# EAGLE schematic csa_vdc_v1.4b (EAGLE 4.15)
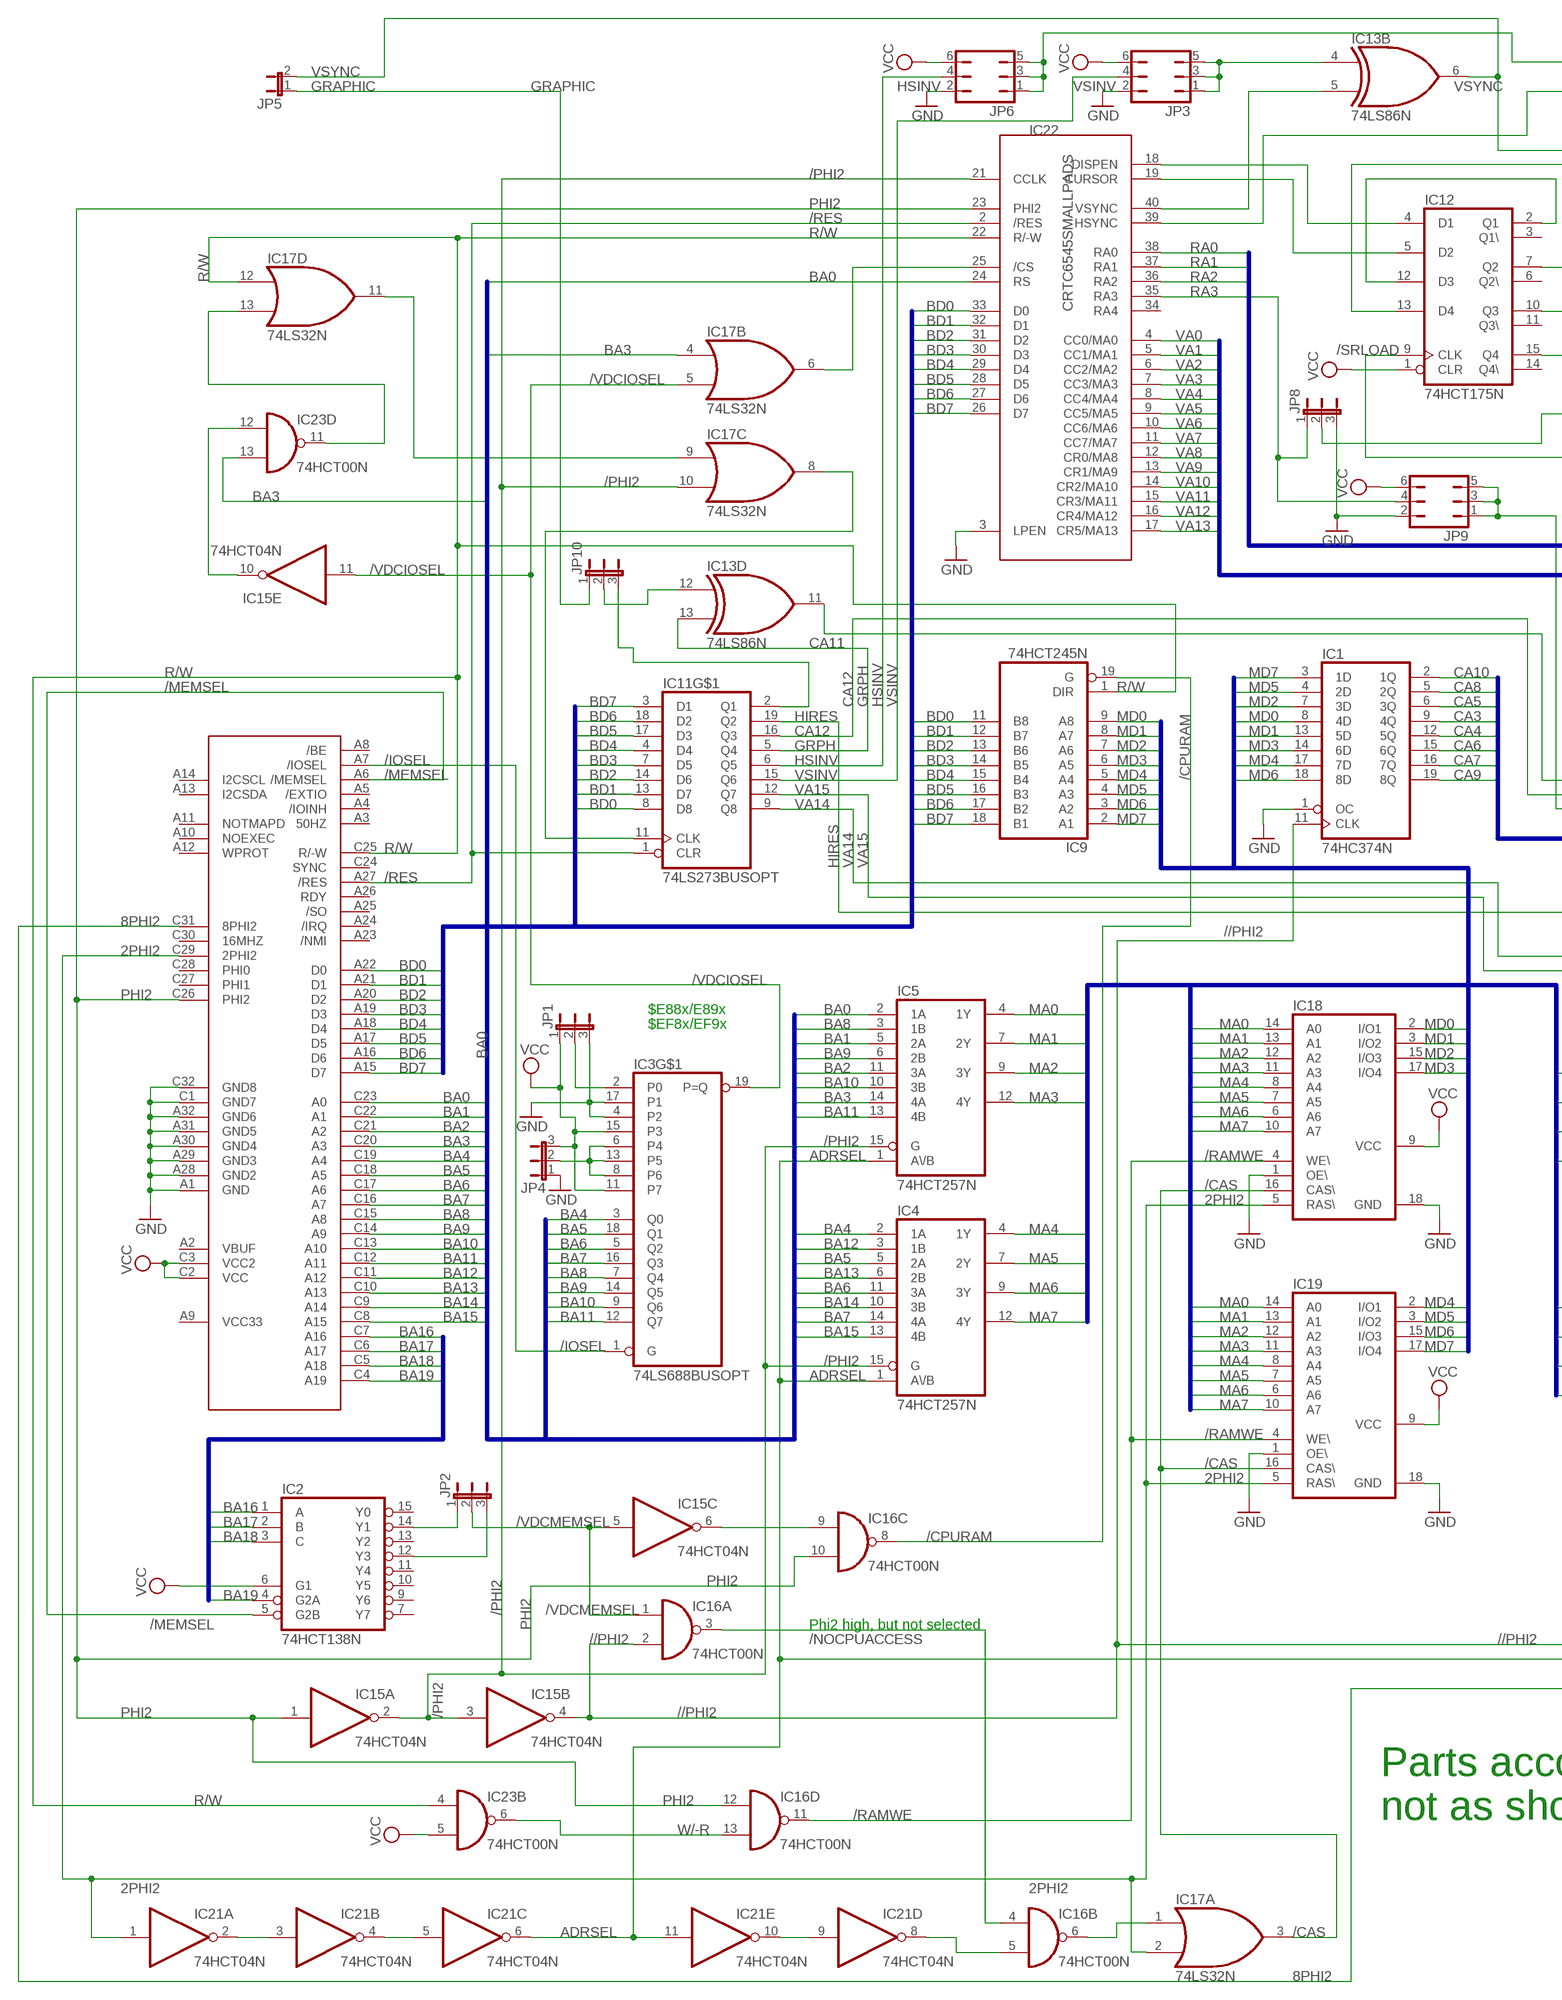
[diagram p0: schematic, sheet 1, part 1 of 2]
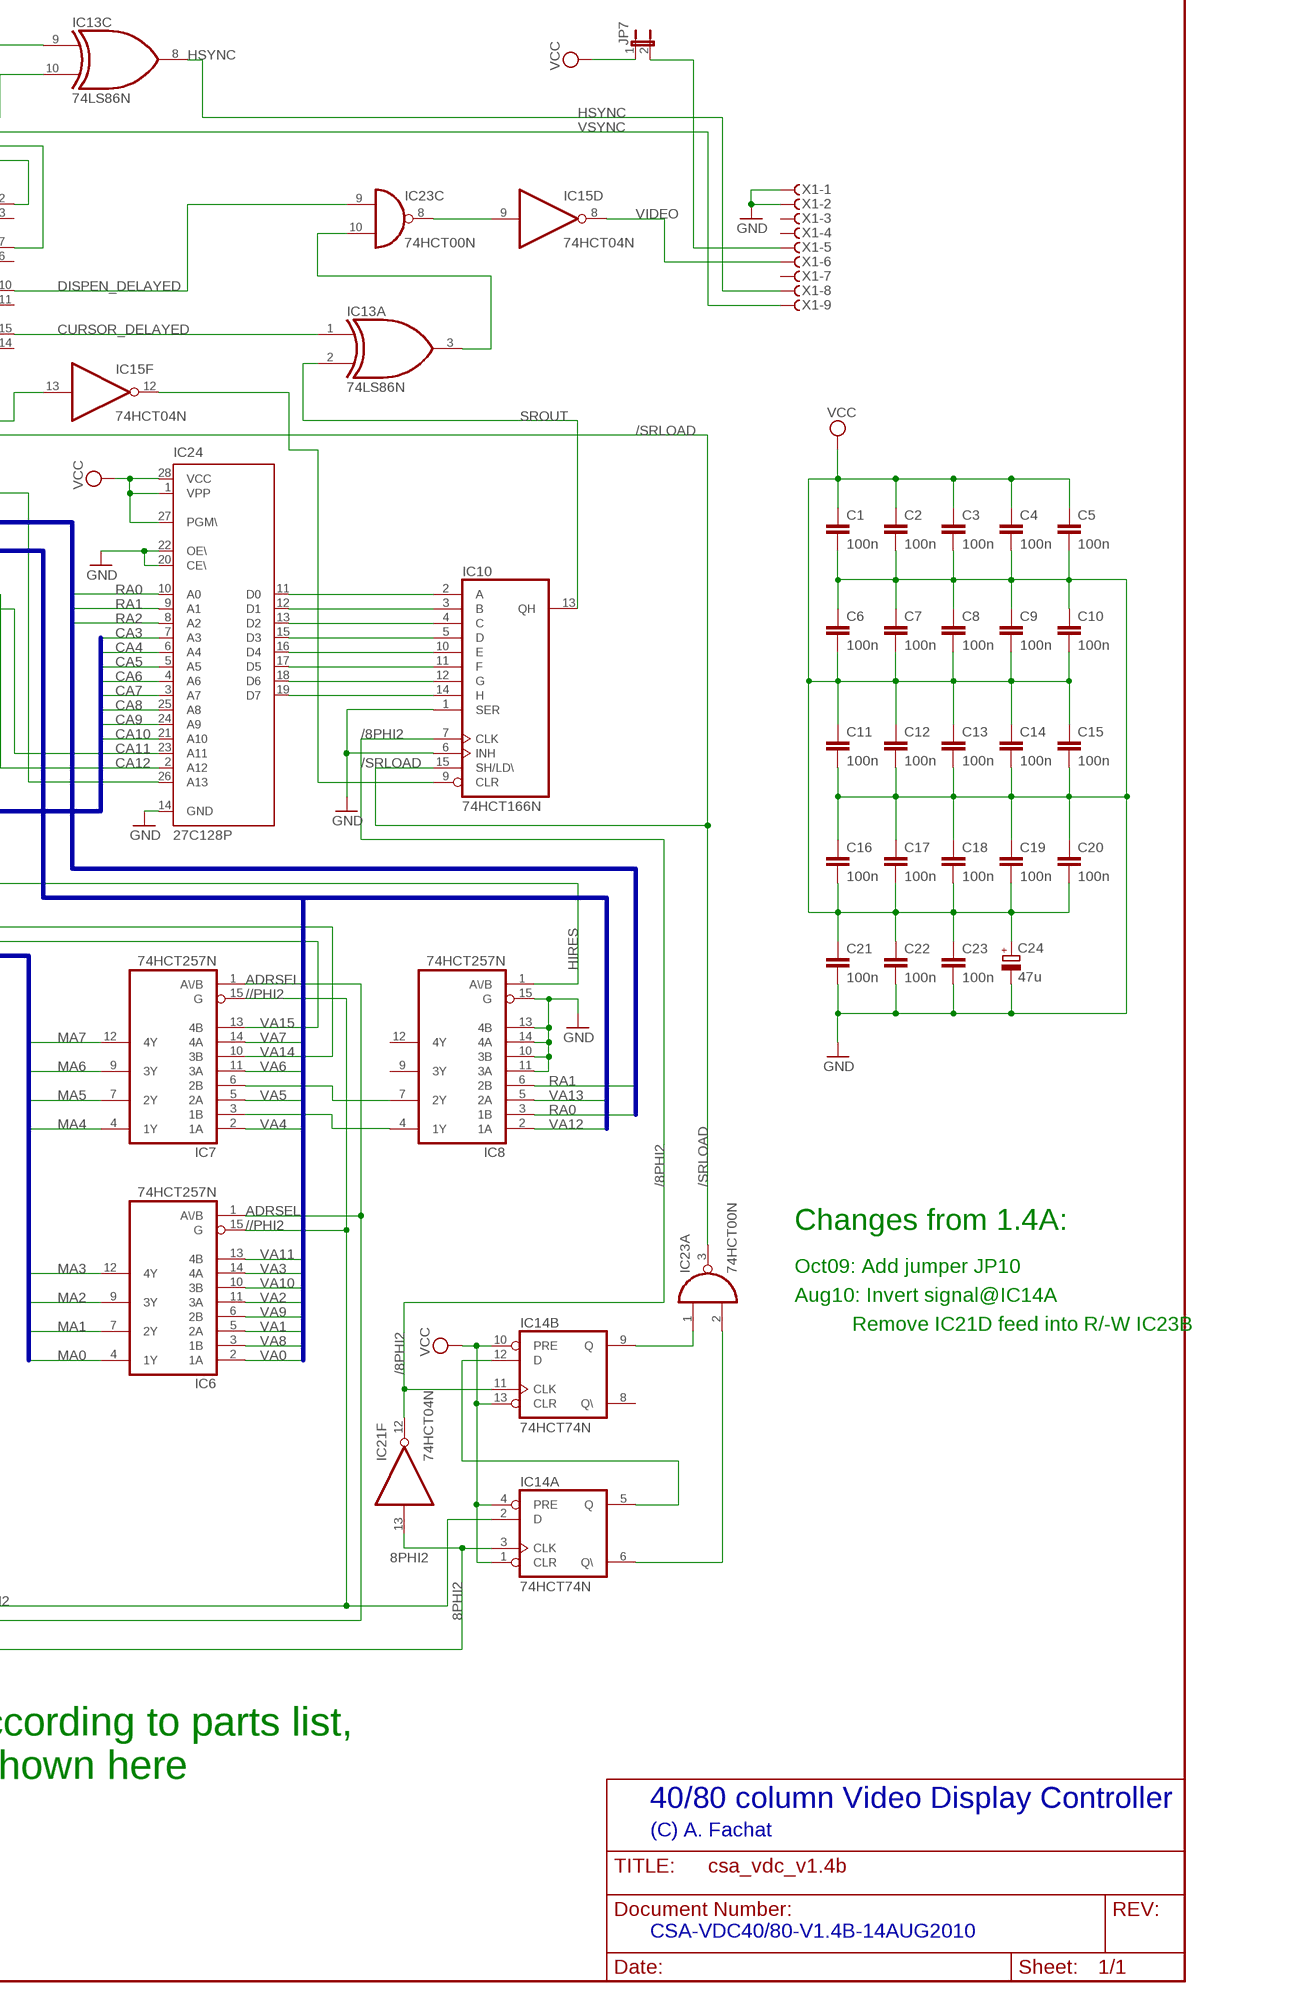
[diagram p1: schematic, sheet 1, part 2 of 2]

## Parts
C1  100n  C-EU025-025X050  [C025-025X050]
C2  100n  C-EU025-025X050  [C025-025X050]
C3  100n  C-EU025-025X050  [C025-025X050]
C4  100n  C-EU025-025X050  [C025-025X050]
C5  100n  C-EU025-025X050  [C025-025X050]
C6  100n  C-EU025-025X050  [C025-025X050]
C7  100n  C-EU025-025X050  [C025-025X050]
C8  100n  C-EU025-025X050  [C025-025X050]
C9  100n  C-EU025-025X050  [C025-025X050]
C10  100n  C-EU025-025X050  [C025-025X050]
C11  100n  C-EU025-025X050  [C025-025X050]
C12  100n  C-EU025-025X050  [C025-025X050]
C13  100n  C-EU025-025X050  [C025-025X050]
C14  100n  C-EU025-025X050  [C025-025X050]
C15  100n  C-EU025-025X050  [C025-025X050]
C16  100n  C-EU025-025X050  [C025-025X050]
C17  100n  C-EU025-025X050  [C025-025X050]
C18  100n  C-EU025-025X050  [C025-025X050]
C19  100n  C-EU025-025X050  [C025-025X050]
C20  100n  C-EU025-025X050  [C025-025X050]
C21  100n  C-EU025-025X050  [C025-025X050]
C22  100n  C-EU025-025X050  [C025-025X050]
C23  100n  C-EU025-025X050  [C025-025X050]
C24  47u  CPOL-EUE2.5-5  [E2,5-5]
IC1  74HC374N  [DIL20]
IC2  74HCT138N  [DIL16]
IC3  74LS688BUSOPT  [DIL20]
IC4  74HCT257N  [DIL16]
IC5  74HCT257N  [DIL16]
IC6  74HCT257N  [DIL16]
IC7  74HCT257N  [DIL16]
IC8  74HCT257N  [DIL16]
IC9  74HCT245N  [DIL20]
IC10  74HCT166N  [DIL16]
IC11  74LS273BUSOPT  [DIL20]
IC12  74HCT175N  [DIL16]
IC13  74LS86N  [DIL14]
IC14  74HCT74N  [DIL14]
IC15  74HCT04N  [DIL14]
IC16  74HCT00N  [DIL14]
IC17  74LS32N  [DIL14]
IC18  41464C  [DIL18]
IC19  41464C  [DIL18]
IC21  74HCT04N  [DIL14]
IC22  CRTC6545SMALLPADS  [DIP40]
IC23  74HCT00N  [DIL14]
IC24  27C128P  [DIL28-6]
JP1  JP2E  [JP2]
JP2  JP2E  [JP2]
JP3  JP3Q  [JP3Q]
JP4  JP2E  [JP2]
JP5  JP1E  [JP1]
JP6  JP3Q  [JP3Q]
JP7  JP1E  [JP1]
JP8  JP2E  [JP2]
JP9  JP3Q  [JP3Q]
JP10  JP2E  [JP2]
U$1  CSABUS  [CSABUS]
X1  F09HPS  [F09HP]

## Nets
2PHI2: IC17.2(A:I1) IC18.5(RAS\) IC19.5(RAS\) IC21.1(A:I) U$1.C29(2PHI2)
8PHI2: IC14.3(A:CLK) IC21.13(F:I) U$1.C31(8PHI2)
/8PHI2: IC10.7(CLK) IC14.11(B:CLK) IC21.12(F:O)
//PHI2: IC1.11(CLK) IC6.15(G) IC7.15(G) IC14.2(A:D) IC15.4(B:O) IC16.2(A:I1)
/CAS: IC17.3(A:O) IC18.16(CAS\) IC19.16(CAS\)
/CPURAM: IC9.19(G) IC16.8(C:O)
/IOSEL: IC3.1(G) U$1.A7(/IOSEL)
/MEMSEL: IC2.5(G2B) U$1.A6(/MEMSEL)
/NOCPUACCESS: IC16.3(A:O) IC16.4(B:I0)
/PHI2: IC4.15(G) IC5.15(G) IC15.2(A:O) IC15.3(B:I) IC17.10(C:I1) IC22.21(CCLK)
/RAMWE: IC16.11(D:O) IC18.4(WE\) IC19.4(WE\)
/RES: IC11.1(CLR) IC22.2(/RES) U$1.A27(/RES)
/SRLOAD: IC10.15(SH/LD\) IC12.9(CLK) IC23.3(A:O)
/VDCIOSEL: IC3.19(P=Q) IC15.11(E:I) IC17.5(B:I1)
/VDCMEMSEL: IC15.5(C:I) IC16.1(A:I0) JP2.2
ADRSEL: IC4.1(A\/B) IC5.1(A\/B) IC6.1(A\/B) IC7.1(A\/B) IC21.6(C:O) IC21.11(E:I)
BA0: IC5.2(1A) IC22.24(RS) U$1.C23(A0)
BA1: IC5.5(2A) U$1.C22(A1)
BA2: IC5.11(3A) U$1.C21(A2)
BA3: IC5.14(4A) IC17.4(B:I0) IC23.13(D:I1) U$1.C20(A3)
BA4: IC3.3(Q0) IC4.2(1A) U$1.C19(A4)
BA5: IC3.18(Q1) IC4.5(2A) U$1.C18(A5)
BA6: IC3.5(Q2) IC4.11(3A) U$1.C17(A6)
BA7: IC3.16(Q3) IC4.14(4A) U$1.C16(A7)
BA8: IC3.7(Q4) IC5.3(1B) U$1.C15(A8)
BA9: IC3.14(Q5) IC5.6(2B) U$1.C14(A9)
BA10: IC3.9(Q6) IC5.10(3B) U$1.C13(A10)
BA11: IC3.12(Q7) IC5.13(4B) U$1.C12(A11)
BA12: IC4.3(1B) U$1.C11(A12)
BA13: IC4.6(2B) U$1.C10(A13)
BA14: IC4.10(3B) U$1.C9(A14)
BA15: IC4.13(4B) U$1.C8(A15)
BA16: IC2.1(A) U$1.C7(A16)
BA17: IC2.2(B) U$1.C6(A17)
BA18: IC2.3(C) U$1.C5(A18)
BA19: IC2.4(G2A) U$1.C4(A19)
BD0: IC9.11(B8) IC11.8(D8) IC22.33(D0) U$1.A22(D0)
BD1: IC9.12(B7) IC11.13(D7) IC22.32(D1) U$1.A21(D1)
BD2: IC9.13(B6) IC11.14(D6) IC22.31(D2) U$1.A20(D2)
BD3: IC9.14(B5) IC11.7(D5) IC22.30(D3) U$1.A19(D3)
BD4: IC9.15(B4) IC11.4(D4) IC22.29(D4) U$1.A18(D4)
BD5: IC9.16(B3) IC11.17(D3) IC22.28(D5) U$1.A17(D5)
BD6: IC9.17(B2) IC11.18(D2) IC22.27(D6) U$1.A16(D6)
BD7: IC9.18(B1) IC11.3(D1) IC22.26(D7) U$1.A15(D7)
CA3: IC1.9(4Q) IC24.7(A3)
CA4: IC1.12(5Q) IC24.6(A4)
CA5: IC1.6(3Q) IC24.5(A5)
CA6: IC1.15(6Q) IC24.4(A6)
CA7: IC1.16(7Q) IC24.3(A7)
CA8: IC1.5(2Q) IC24.25(A8)
CA9: IC1.19(8Q) IC24.24(A9)
CA10: IC1.2(1Q) IC24.21(A10)
CA11: IC13.11(D:O) IC24.23(A11)
CA12: IC11.16(Q3) IC24.2(A12)
CURSOR_DELAYED: IC12.15(Q4) IC13.1(A:I0)
DISPEN_DELAYED: IC12.10(Q3) IC23.9(C:I0)
GND: C1.2 C2.2 C3.2 C4.2 C5.2 C6.1 C7.1 C8.1 C9.1 C10.1 C11.2 C12.2 C13.2 C14.2 C15.2 C16.1 C17.1 C18.1 C19.1 C20.1 C21.2 C22.2 C23.2 C24.- IC1.1(OC) IC3.4(P2) IC3.17(P1) IC8.10(3B) IC8.11(3A) IC8.13(4B) IC8.14(4A) IC8.15(G) IC10.1(SER) IC10.6(INH) IC18.1(OE\) IC18.18(GND) IC19.1(OE\) IC19.18(GND) IC22.3(LPEN) IC24.14(GND) IC24.20(CE\) IC24.22(OE\) JP1.3 JP3.2 JP4.1 JP6.2 JP8.3 JP9.2 U$1.A1(GND) U$1.A28(GND2) U$1.A29(GND3) U$1.A30(GND4) U$1.A31(GND5) U$1.A32(GND6) U$1.C1(GND7) U$1.C32(GND8) X1.1 X1.2
GRAPHIC: JP5.1 JP10.1
GRPH: IC11.5(Q4) IC13.13(D:I1)
HIRES: IC8.1(A\/B) IC11.19(Q2)
HSINV: IC11.6(Q5) JP6.4
HSYNC: IC13.8(C:O) X1.8
MA0: IC5.4(1Y) IC6.4(1Y) IC18.14(A0) IC19.14(A0)
MA1: IC5.7(2Y) IC6.7(2Y) IC18.13(A1) IC19.13(A1)
MA2: IC5.9(3Y) IC6.9(3Y) IC18.12(A2) IC19.12(A2)
MA3: IC5.12(4Y) IC6.12(4Y) IC18.11(A3) IC19.11(A3)
MA4: IC4.4(1Y) IC7.4(1Y) IC18.8(A4) IC19.8(A4)
MA5: IC4.7(2Y) IC7.7(2Y) IC18.7(A5) IC19.7(A5)
MA6: IC4.9(3Y) IC7.9(3Y) IC18.6(A6) IC19.6(A6)
MA7: IC4.12(4Y) IC7.12(4Y) IC18.10(A7) IC19.10(A7)
MD0: IC1.8(4D) IC9.9(A8) IC18.2(I/O1)
MD1: IC1.13(5D) IC9.8(A7) IC18.3(I/O2)
MD2: IC1.7(3D) IC9.7(A6) IC18.15(I/O3)
MD3: IC1.14(6D) IC9.6(A5) IC18.17(I/O4)
MD4: IC1.17(7D) IC9.5(A4) IC19.2(I/O1)
MD5: IC1.4(2D) IC9.4(A3) IC19.3(I/O2)
MD6: IC1.18(8D) IC9.3(A2) IC19.15(I/O3)
MD7: IC1.3(1D) IC9.2(A1) IC19.17(I/O4)
N$9: IC7.3(1B) IC8.4(1Y)
N$10: IC3.2(P0) JP1.2
N$11: IC7.6(2B) IC8.7(2Y)
N$12: IC10.2(A) IC24.11(D0)
N$13: IC10.3(B) IC24.12(D1)
N$14: IC10.4(C) IC24.13(D2)
N$15: IC10.5(D) IC24.15(D3)
N$16: IC10.10(E) IC24.16(D4)
N$17: IC10.11(F) IC24.17(D5)
N$18: IC10.12(G) IC24.18(D6)
N$19: IC10.14(H) IC24.19(D7)
N$20: IC2.14(Y1) JP2.1
N$21: IC2.12(Y3) JP2.3
N$22: IC14.6(A:Q\) IC23.2(A:I1)
N$23: IC14.9(B:Q) IC23.1(A:I0)
N$24: IC11.11(CLK) IC17.8(C:O)
N$25: IC12.4(D1) IC22.18(DISPEN)
N$26: IC3.6(P4) IC3.8(P6) IC3.13(P5) JP4.2
N$27: IC21.2(A:O) IC21.3(B:I)
N$28: IC21.4(B:O) IC21.5(C:I)
N$29: IC12.5(D2) IC22.19(CURSOR)
N$30: IC21.9(D:I) IC21.10(E:O)
N$31: IC13.9(C:I0) JP6.1 JP6.3 JP6.5
N$32: IC16.5(B:I1) IC21.8(D:O)
N$33: IC16.6(B:O) IC17.1(A:I0)
N$34: IC17.13(D:I1) IC23.11(D:O)
N$35: IC15.6(C:O) IC16.9(C:I0)
N$36: IC12.2(Q1) IC12.12(D3)
N$37: IC12.7(Q2) IC12.13(D4)
N$38: IC13.4(B:I0) JP3.1 JP3.3 JP3.5
N$39: IC10.9(CLR) IC15.12(F:O)
N$40: IC13.3(A:O) IC23.10(C:I1)
N$41: JP7.2 X1.5
N$42: IC15.9(D:I) IC23.8(C:O)
N$43: IC14.5(A:Q) IC14.12(B:D)
N$44: IC13.5(B:I1) IC22.40(VSYNC)
N$45: IC15.13(F:I) JP8.2
N$46: IC24.26(A13) JP9.1 JP9.3 JP9.5
N$48: IC13.10(C:I1) IC22.39(HSYNC)
N$49: IC11.2(Q1) JP10.3
N$50: IC13.12(D:I0) JP10.2
N$52: IC17.6(B:O) IC22.25(/CS)
N$54: IC15.10(E:O) IC23.12(D:I0)
N$55: IC17.9(C:I0) IC17.11(D:O)
PHI2: IC15.1(A:I) IC16.10(C:I1) IC16.12(D:I0) IC22.23(PHI2) U$1.C26(PHI2)
R/W: IC9.1(DIR) IC17.12(D:I0) IC22.22(R/-W) IC23.4(B:I0) U$1.C25(R/-W)
RA0: IC8.3(1B) IC22.38(RA0) IC24.10(A0)
RA1: IC8.6(2B) IC22.37(RA1) IC24.9(A1)
RA2: IC22.36(RA2) IC24.8(A2)
RA3: IC22.35(RA3) JP8.1 JP9.4
SROUT: IC10.13(QH) IC13.2(A:I1)
VA0: IC6.2(1A) IC22.4(CC0/MA0)
VA1: IC6.5(2A) IC22.5(CC1/MA1)
VA2: IC6.11(3A) IC22.6(CC2/MA2)
VA3: IC6.14(4A) IC22.7(CC3/MA3)
VA4: IC7.2(1A) IC22.8(CC4/MA4)
VA5: IC7.5(2A) IC22.9(CC5/MA5)
VA6: IC7.11(3A) IC22.10(CC6/MA6)
VA7: IC7.14(4A) IC22.11(CC7/MA7)
VA8: IC6.3(1B) IC22.12(CR0/MA8)
VA9: IC6.6(2B) IC22.13(CR1/MA9)
VA10: IC6.10(3B) IC22.14(CR2/MA10)
VA11: IC6.13(4B) IC22.15(CR3/MA11)
VA12: IC8.2(1A) IC22.16(CR4/MA12)
VA13: IC8.5(2A) IC22.17(CR5/MA13)
VA14: IC7.10(3B) IC11.9(Q8)
VA15: IC7.13(4B) IC11.12(Q7)
VCC: C1.1 C2.1 C3.1 C4.1 C5.1 C6.2 C7.2 C8.2 C9.2 C10.2 C11.1 C12.1 C13.1 C14.1 C15.1 C16.2 C17.2 C18.2 C19.2 C20.2 C21.1 C22.1 C23.1 C24.+ IC2.6(G1) IC3.11(P7) IC3.15(P3) IC12.1(CLR) IC14.1(A:CLR) IC14.4(A:PRE) IC14.10(B:PRE) IC14.13(B:CLR) IC18.9(VCC) IC19.9(VCC) IC23.5(B:I1) IC24.1(VPP) IC24.27(PGM\) IC24.28(VCC) JP1.1 JP3.6 JP4.3 JP6.6 JP7.1 JP9.6 U$1.C2(VCC) U$1.C3(VCC2)
VIDEO: IC15.8(D:O) X1.6
VSINV: IC11.15(Q6) JP3.4
VSYNC: IC13.6(B:O) JP5.2 X1.9
W/-R: IC16.13(D:I1) IC23.6(B:O)
Unconnected: IC2.7(Y7) IC2.9(Y6) IC2.10(Y5) IC2.11(Y4) IC2.13(Y2) IC2.15(Y0) IC8.9(3Y) IC8.12(4Y) IC12.3(Q1\) IC12.6(Q2\) IC12.11(Q3\) IC12.14(Q4\) IC14.8(B:Q\) IC22.34(RA4) U$1.A2(VBUF) U$1.A3(50HZ) U$1.A4(/IOINH) U$1.A5(/EXTIO) U$1.A8(/BE) U$1.A9(VCC33) U$1.A10(NOEXEC) U$1.A11(NOTMAPD) U$1.A12(WPROT) U$1.A13(I2CSDA) U$1.A14(I2CSCL) U$1.A23(/NMI) U$1.A24(/IRQ) U$1.A25(/SO) U$1.A26(RDY) U$1.C24(SYNC) U$1.C27(PHI1) U$1.C28(PHI0) U$1.C30(16MHZ) X1.3 X1.4 X1.7

## Buses
BA[16..19]
BA[0..15]
MA[0..7]
BD[0..7]
MD[0..7]
VA[0..13]
RA[0..4]
CA[3..10]

## Notes on the sheet
- $E88x/E89x
- $EF8x/EF9x
- Changes from 1.4A:
- Oct09: Add jumper JP10
- Aug10: Invert signal@IC14A
- Remove IC21D feed into R/-W IC23B
- Phi2 high, but not selected
- Parts according to parts list,
- not as shown here
- 40/80 column Video Display Controller
- (C) A. Fachat
- CSA-VDC40/80-V1.4B-14AUG2010

## Power pins joined to a net without a drawn wire
GND: IC1.10(GND) IC2.8(GND) IC3.10(GND) IC4.8(GND) IC5.8(GND) IC6.8(GND) IC7.8(GND) IC8.8(GND) IC9.10(GND) IC10.8(GND) IC11.10(GND) IC12.8(GND) IC13.7(P:GND) IC14.7(P:GND) IC15.7(P:GND) IC16.7(P:GND) IC17.7(P:GND) IC21.7(P:GND) IC22.1(GND) IC23.7(P:GND)
VCC: IC1.20(VCC) IC2.16(VCC) IC3.20(VCC) IC4.16(VCC) IC5.16(VCC) IC6.16(VCC) IC7.16(VCC) IC8.16(VCC) IC9.20(VCC) IC10.16(VCC) IC11.20(VCC) IC12.16(VCC) IC13.14(P:VCC) IC14.14(P:VCC) IC15.14(P:VCC) IC16.14(P:VCC) IC17.14(P:VCC) IC21.14(P:VCC) IC22.20(VCC) IC23.14(P:VCC)

## Library data of the parts
C1-C23 = rcl:C-EU: CAPACITOR, European symbol
C24 = rcl:CPOL-EU: POLARIZED CAPACITOR, European symbol
IC1 = 74xx-eu:74*374: Octal D type transparent LATCH, edge triggered
IC2 = 74xx-eu:74*138: 3-line to 8-line DECODER/DEMULTIPLEXER
IC3 = csa:74LS688BUSOPT
IC4-IC8 = 74xx-eu:74*257: Quadruple 2-to 1 line data SELECTOR/MULTIPLEXER
IC9 = 74xx-eu:74*245: Octal BUS TRANSCEIVER, 3-state
IC10 = 74xx-eu:74*166: 8-bit parallel load SHIFT REGISTER
IC11 = csa:74LS273BUSOPT
IC12 = 74xx-eu:74*175: Qadruple D type FLIP FLOP, clear
IC13 = 74xx-us:74*86: Quad 2-input EXCLUSIV-OR (XOR) gate
IC14 = 74xx-eu:74*74: Dual D type positive edge triggered FLIP FLOP, preset and clear
IC15 IC21 = 74xx-eu:74*04: Hex INVERTER
IC16 IC23 = 74xx-eu:74*00: Quad 2-input NAND gate
IC17 = 74xx-us:74*32: Quad 2-input OR gate
IC18 IC19 = memory-nec:41464C: MEMORY
IC22 = csa:CRTC6545
IC24 = microchip:27*128: CMOS EPROM 128 K (16 K x 8)
JP1 JP2 JP4 JP8 JP10 = jumper:JP2E: JUMPER
JP3 JP6 JP9 = jumper:JP3Q: JUMPER
JP5 JP7 = jumper:JP1E: JUMPER
U$1 = csa:CSABUS
X1 = con-subd:F09?S: SUB-D